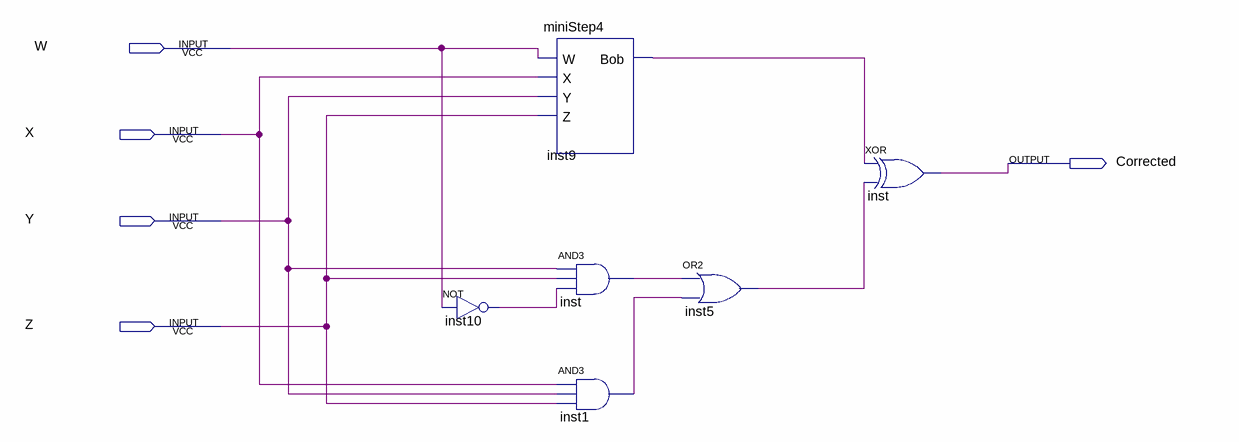
[diagram p0: schematic sheet]
// Quartus schematic miniStep8.bdf as structural Verilog: 6 symbols, 5 pins
module miniStep8 (
  input  W,
  input  X,
  input  Y,
  input  Z,
  output Corrected
);

  wire inst1_out, inst5_out, inst9_bob, inst10_out, inst_out;

  not inst10 (inst10_out, W);
  miniStep4 inst9 (.W(W), .X(X), .Y(Y), .Z(Z), .Bob(inst9_bob));
  and inst (inst_out, Y, Z, inst10_out);
  and inst1 (inst1_out, X, Y, Z);
  or inst5 (inst5_out, inst_out, inst1_out);
  xor inst_dup2 (Corrected, inst9_bob, inst5_out);
endmodule
